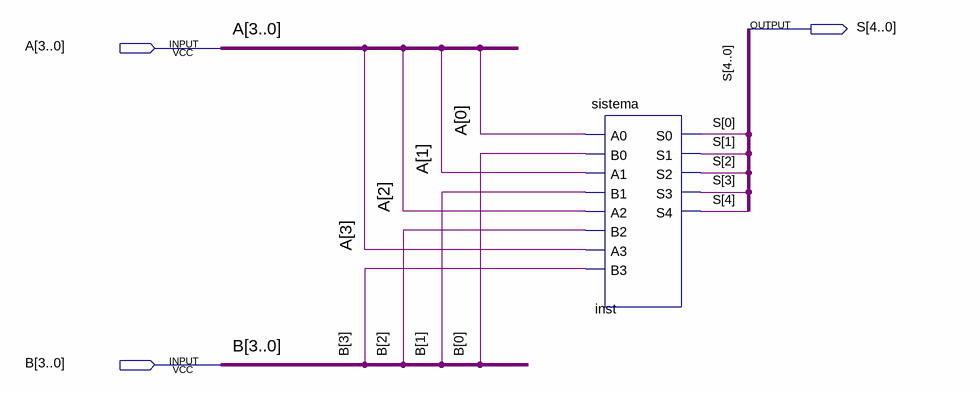
[diagram p0: schematic sheet]
// Quartus schematic Somador_Completin.bdf as structural Verilog: 1 symbols, 3 pins
module Somador_Completin (
  input  [3:0] A,
  input  [3:0] B,
  output [4:0] S
);

  sistema inst (
    .A0(A[0]), .B0(B[0]), .A1(A[1]), .B1(B[1]), .A2(A[2]), .B2(B[2]), .A3(A[3]), .B3(B[3]), .S0(S[0]),
    .S1(S[1]), .S2(S[2]), .S3(S[3]), .S4(S[4]));
endmodule
